# EAGLE design pure_energy (EAGLE 9.5.2)
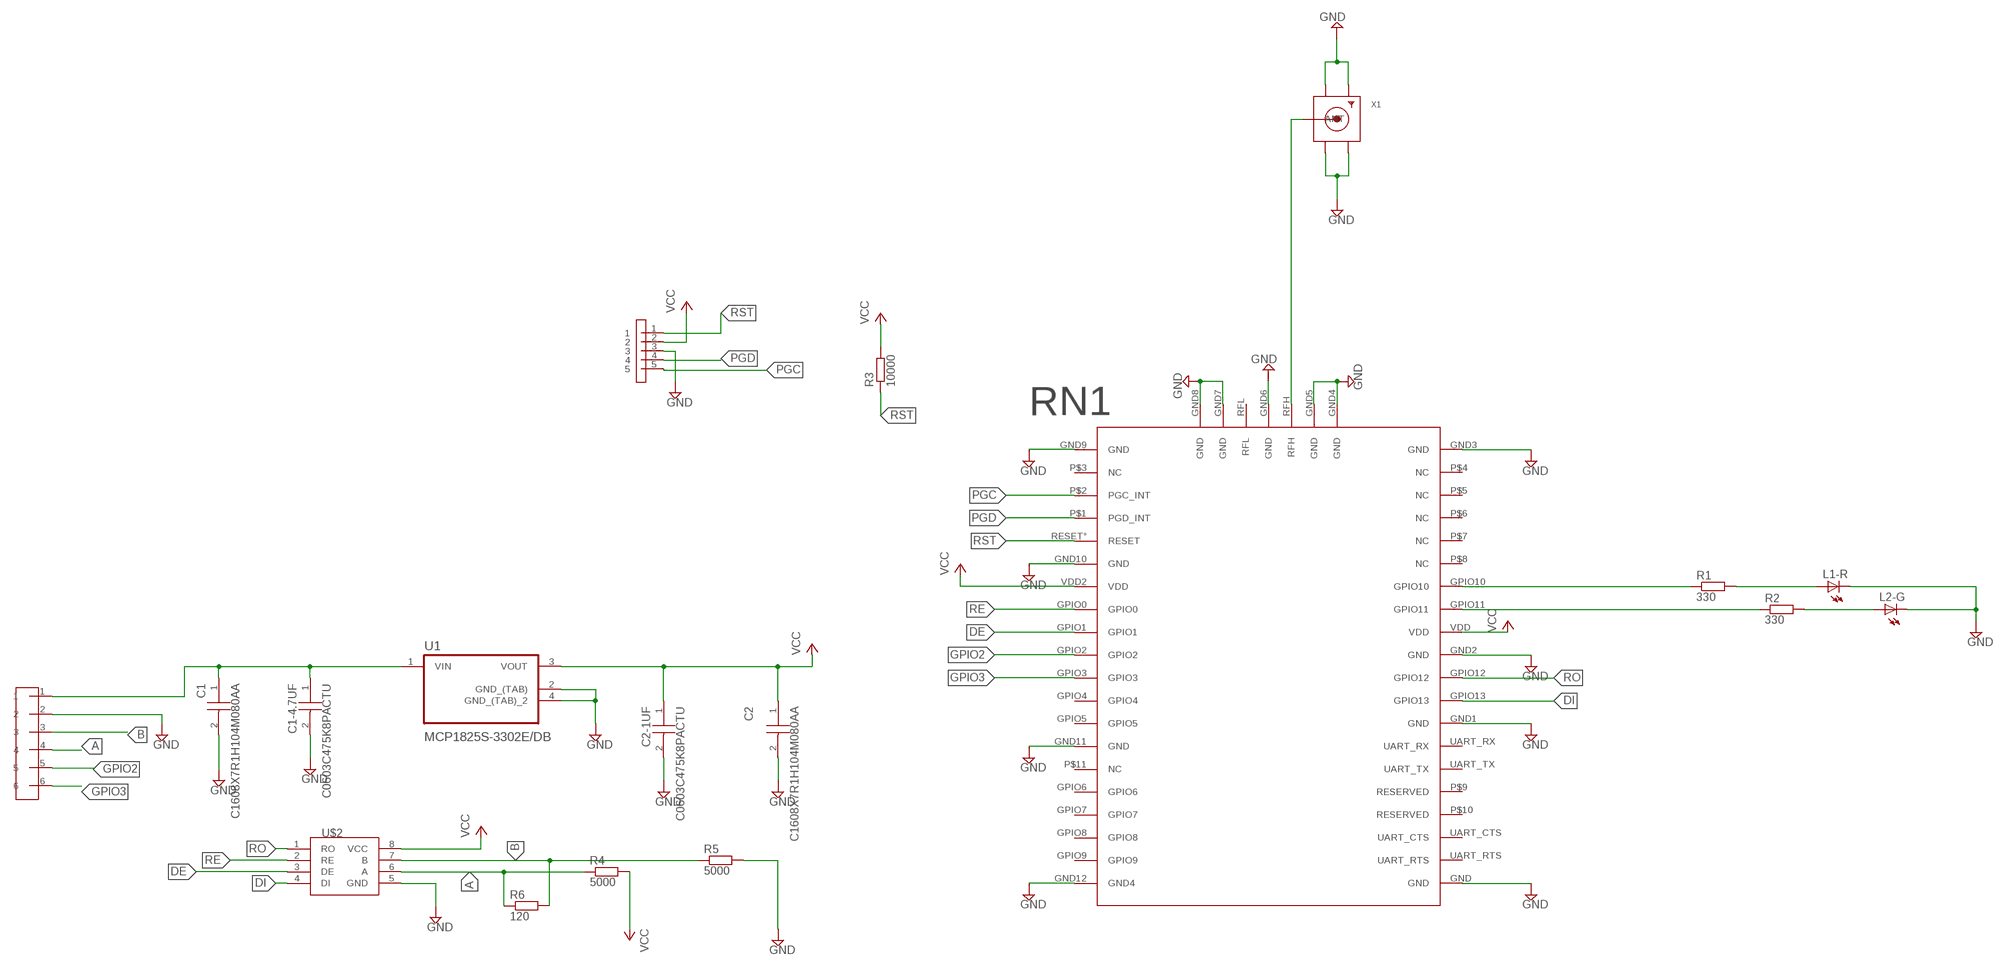
[diagram p0: schematic, sheet 1]

## Parts
C1  C1608X7R1H104M080AA  [CAPC1608X80N]
C1-4.7UF  C0603C475K8PACTU  [CAPC1608X85N]
C2  C1608X7R1H104M080AA  [CAPC1608X80N]
C2-1UF  C0603C475K8PACTU  [CAPC1608X85N]
L1-R  LEDCHIP-LED0603  [CHIP-LED0603]
L2-G  LEDCHIP-LED0603  [CHIP-LED0603]
R1  330  R-EU_R0603  [R0603]
R2  330  R-EU_R0603  [R0603]
R3  10000  R-EU_R0603  [R0603]
R4  5000  R-EU_R0805  [R0805]
R5  5000  R-EU_R0805  [R0805]
R6  120  R-EU_R0805  [R0805]
RN1  NEW_RN2483  [NEW_RN2483]
U1  MCP1825S-3302E/DB  [SOT230P700X180-4N]
U$1  CONNECTOR62  [CONNECTOR6]
U$2  AMD3485E  [AMD3485E]
U$3  ICSP52  [ICSP]
X1  SMACONNECTOR_EDGE  [SMA_EDGELAUNCH]

## Nets
A: R4.1 R6.1 U$1.4 U$2.6(A)
B: R5.1 R6.2 U$1.3 U$2.7(B)
DE: RN1.GPIO1 U$2.3(DE)
DI: RN1.GPIO13 U$2.4(DI)
GND: C1-4.7UF.2(C2) C1.2 C2-1UF.2(C2) C2.2 L1-R.C L2-G.C R5.2 RN1.GND RN1.GND1(GND) RN1.GND2(GND) RN1.GND3(GND) RN1.GND4(GND) RN1.GND5(GND) RN1.GND6(GND) RN1.GND7(GND) RN1.GND8(GND) RN1.GND9(GND) RN1.GND10(GND) RN1.GND11(GND) RN1.GND12(GND4) U1.2(GND_(TAB)) U1.4(GND_(TAB)_2) U$1.2 U$2.5(GND) U$3.3 X1.GND@1(GND4) X1.GND@2(GND3) X1.GND@3(GND2) X1.GND@4(GND1)
GPIO2: RN1.GPIO2 U$1.5
GPIO3: RN1.GPIO3 U$1.6
N$1: C1-4.7UF.1(C1) C1.1 U1.1(VIN) U$1.1
N$10: R1.1 RN1.GPIO10
N$11: R2.1 RN1.GPIO11
N$12: L1-R.A R1.2
N$13: L2-G.A R2.2
N$15: RN1.RFH X1.P(ANT)
PGC: RN1.P$2(PGC_INT) U$3.5
PGD: RN1.P$1(PGD_INT) U$3.4
RE: RN1.GPIO0 U$2.2(RE)
RO: RN1.GPIO12 U$2.1(RO)
RST: R3.1 RN1.RESET°(RESET) U$3.1
VCC: C2-1UF.1(C1) C2.1 R3.2 R4.2 RN1.VDD RN1.VDD2(VDD) U1.3(VOUT) U$2.8(VCC) U$3.2
Unconnected: RN1.GPIO4 RN1.GPIO5 RN1.GPIO6 RN1.GPIO7 RN1.GPIO8 RN1.GPIO9 RN1.P$3(NC) RN1.P$4(NC) RN1.P$5(NC) RN1.P$6(NC) RN1.P$7(NC) RN1.P$8(NC) RN1.P$9(RESERVED) RN1.P$10(RESERVED) RN1.P$11(NC) RN1.RFL RN1.UART_CTS RN1.UART_RTS RN1.UART_RX RN1.UART_TX

## Library data of the parts
C1 C2 = C1608X7R1H104M080AA:C1608X7R1H104M080AA: TDK 0603 C 100nF Ceramic Multilayer Capacitor, 50 V dc, +125C, X7R Dielectric, +/-20% Source: Datasheet <https://product.tdk.com/info/en/catalog/datasheets/mlcc_commercial_midvoltage_en.pdf>; ARROW_PART_NUMBER: C1608X7R1H104M080AA; ARROW_PRICE-STOCK: https://www.arrow.com/en/products/c1608x7r1h104m080aa/tdk; DESCRIPTION: TDK 0603 C 100nF Ceramic Multilayer Capacitor, 50 V dc, +125C, X7R Dielectric, +/-20%; HEIGHT: 0.8mm; MANUFACTURER_NAME: TDK; MANUFACTURER_PART_NUMBER: C1608X7R1H104M080AA; MOUSER_PART_NUMBER: 810-C1608X7R1H104M; MOUSER_PRICE-STOCK: https://www.mouser.co.uk/ProductDetail/TDK/C1608X7R1H104M080AA?qs=dfay7wIA1uEL2BE%2FFUaTdg%3D%3D
C1-4.7UF C2-1UF = C0603C475K8PACTU:C0603C475K8PACTU: CAPACITOR, 0603 4.7uF +/-10% 10V Source: Datasheet <http://componentsearchengine.com/Datasheets/1/C0603C475K8PACTU.pdf>; ARROW_PART_NUMBER: C0603C475K8PACTU; ARROW_PRICE-STOCK: https://www.arrow.com/en/products/c0603c475k8pactu/kemet-corporation; DESCRIPTION: CAPACITOR, 0603 4.7uF +/-10% 10V; HEIGHT: mm; MANUFACTURER_NAME: Kemet; MANUFACTURER_PART_NUMBER: C0603C475K8PACTU; MOUSER_PART_NUMBER: 80-C0603C475K8P; MOUSER_PRICE-STOCK: https://www.mouser.co.uk/ProductDetail/KEMET/C0603C475K8PACTU?qs=K%2Fj%2Fqf%252B0fqK6lAUxhlPmKA%3D%3D
L1-R L2-G = adafruit:LED: LED OSRAM: - CHIPLED LG R971, LG N971, LY N971, LG Q971, LY Q971, LO R971, LY R971 LH N974, LH R974 LS Q976, LO Q976, LY Q976 LO Q996 - Hyper CHIPLED LW Q18S LB Q993, LB Q99A, LB R99A - SideLED LS A670, LO A670, LY A670, LG A670, LP A670 LB A673, LV A673, LT A673, LW A673 LH A674 LY A675 LS A676, LA A676, LO A676, LY A676, LW A676 LS A679, LY A679, LG A679 - Hyper Micro SIDELED® LS Y876, LA Y876, LO Y876, LY Y876 LT Y87S - SmartLED LW L88C, LW L88S LB L89C, LB L89S, LG L890 LS L89K, LO L89K, LY L89K LS L896, LA L896, LO L896, LY L896 - TOPLED LS T670, LO T670, LY T670, LG T670, LP T670 LSG T670, LSP T670, LSY T670, LOP T670, LYG T670 LG T671, LOG T671, LSG T671 LB T673, LV T673, LT T673, LW T673 LH T674 LS T676, LA T676, LO T676, LY T676, LB T676, LH T676, LSB T676, LW T676 LB T67C, LV T67C, LT T67C, LS T67K, LO T67K, LY T67K, LW E67C LS E67B, LA E67B, LO E67B, LY E67B, LB E67C, LV E67C, LT E67C LW T67C LS T679, LY T679, LG T679 LS T770, LO T770, LY T770, LG T770, LP T770 LB T773, LV T773, LT T773, LW T773 LH T774 LS E675, LA E675, LY E675, LS T675 LS T776, LA T776, LO T776, LY T776, LB T776 LHGB T686 LT T68C, LB T68C - Hyper Mini TOPLED® LB M676 - Mini TOPLED Santana® LG M470 LS M47K, LO M47K, LY M47K Source: http://www.osram.convergy.de/
R1-R6 = rcl:R-EU_: RESISTOR, European symbol; SPICEPREFIX: R
RN1 = tobias:NEW_RN2483
U1 = MCP1825S-3302E_DB:MCP1825S-3302E/DB; AVAILABILITY: Unavailable; DESCRIPTION: Linear Voltage Regulator IC 1 Output 500mA SOT-223-3; MF: Microchip; MP: MCP1825S-3302E/DB; PACKAGE: SOT-223 Microchip; PRICE: None
U$1 = conn4:CONNECTOR62
U$2 = AMD3485E:AMD3485E
U$3 = conn4:ICSP52
X1 = adafruit:SMACONNECTOR: SMA Connector 90° DIP SMA Connector, 50 Ohm (4UConnector: 07259)

## Net classes
0 default: width 0.305 mm, drill 0.508 mm, clearance 0.254 mm

## Board
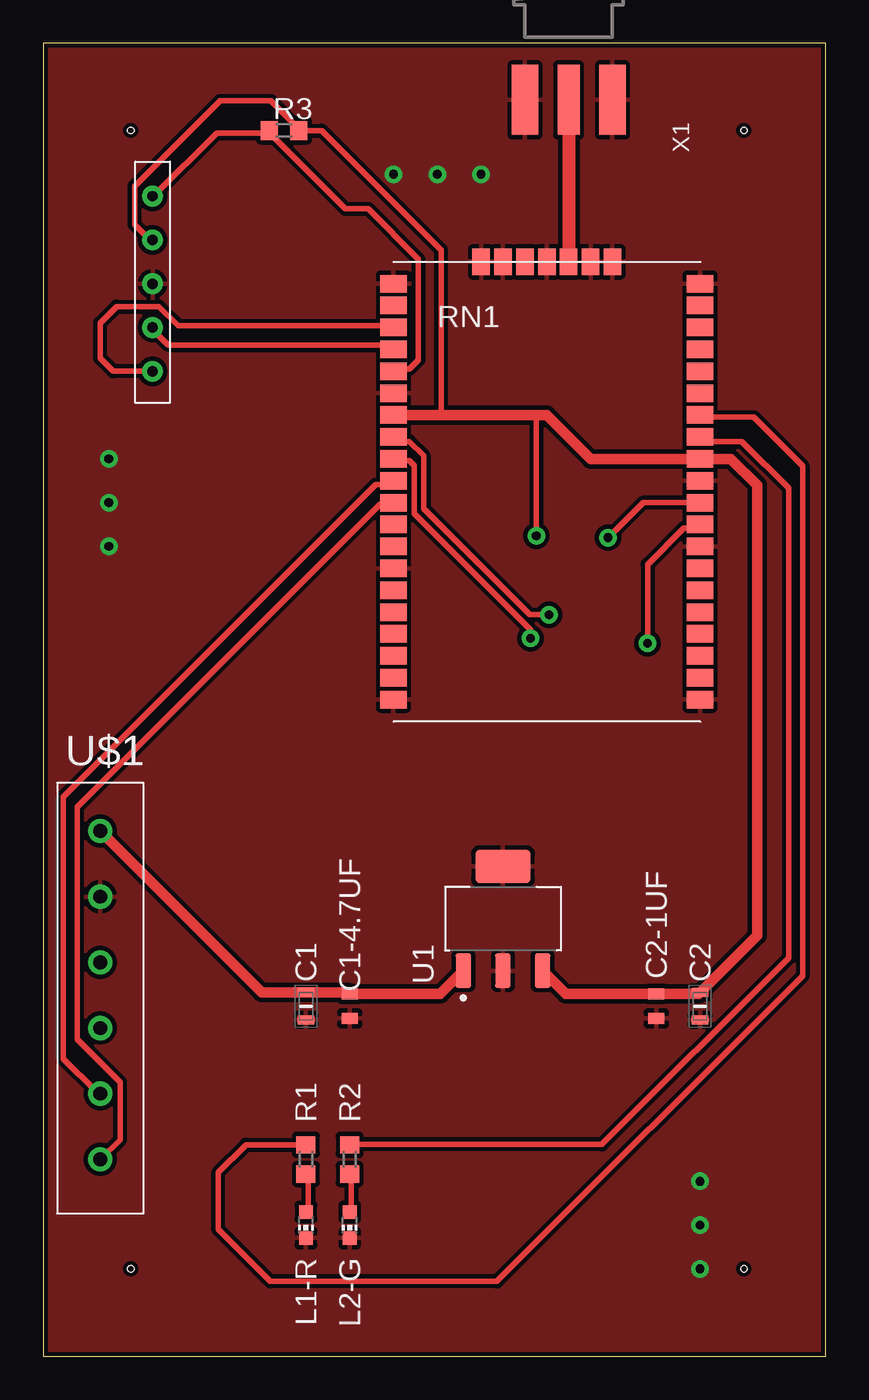
[diagram p1: board, top side]
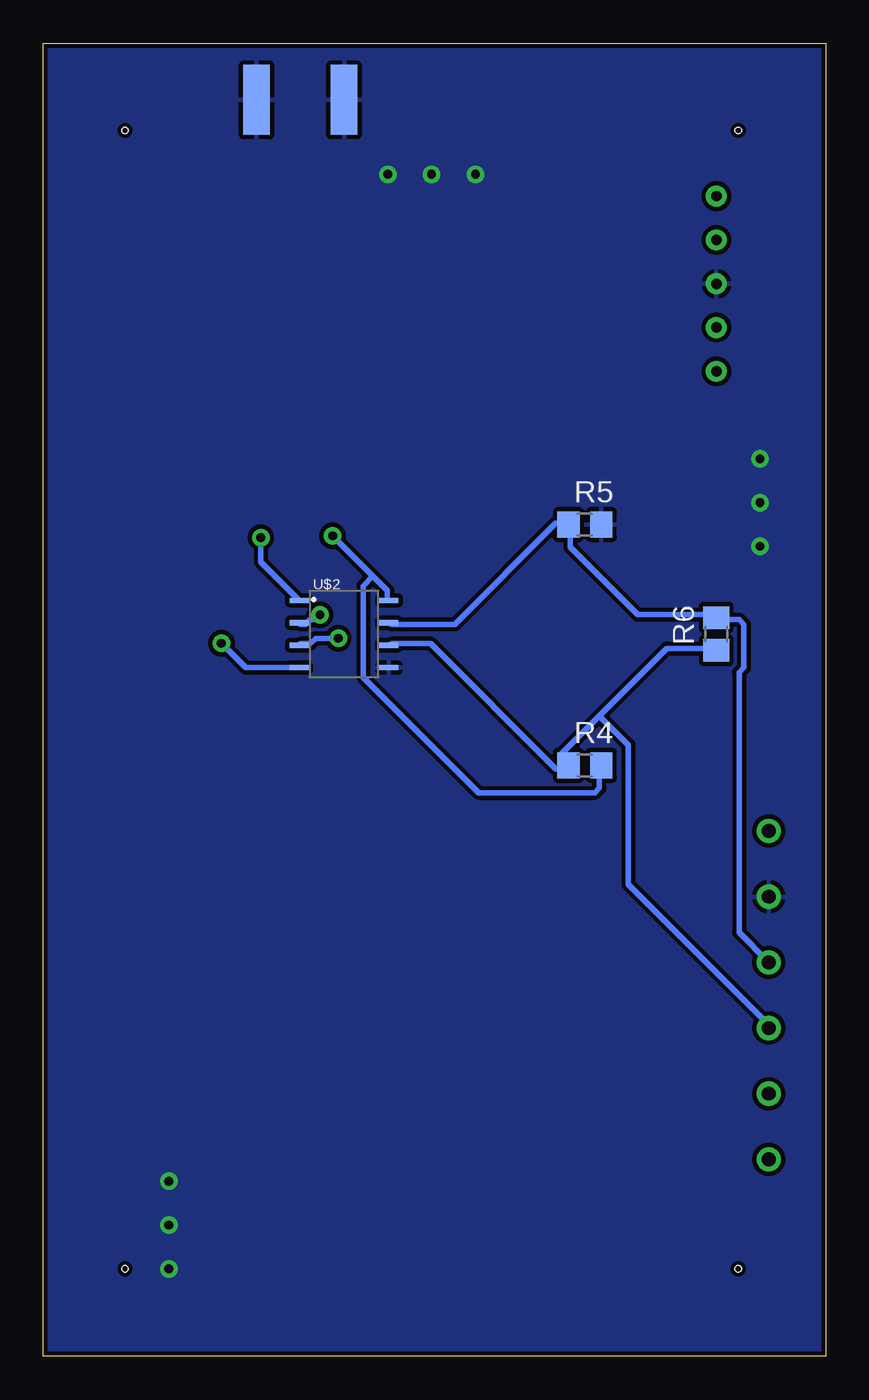
[diagram p2: board, bottom side, seen from below]

Size 45.39 x 76.19 mm. Coordinates in mm from the lower left corner, seen from the top.
Outline: 0,0 45.39,0 45.39,76.19 0,76.19 0,0
Copper layers (1*16): Top 0.035mm / dielectric 1.5mm / Bottom 0.035mm
Design rules "SparkFun": minimum track width 8mil, minimum drill 20mil, track to track 8mil, track to pad 8mil, pad to pad 8mil, via to via 8mil, smd to smd 8mil, copper to edge 10mil, drill to drill 8mil, minimum pad ring 12mil, minimum via ring 10mil, stop-mask expansion 4mil, vias tented up to drill 25mil, thermal gap 10mil
Holes 0.35 mm at 40.64,71.12 5.08,71.12 5.08,5.08 40.64,5.08

### Footprints (pad centres in the part's own frame; a part is rotated, then mirrored left to right if it is on the bottom)
CAPC1608X80N = smd 0.54 x 0.94: 1 -0.8,0; 2 0.8,0
CAPC1608X85N = smd 0.66 x 0.94: 1 -0.711,0; 2 0.711,0
CHIP-LED0603 = smd 0.8 x 0.8: A 0,-0.75; C 0,0.75
R0603 = smd 1 x 1.1: 1 -0.85,0; 2 0.85,0
R0805 = smd 1.3 x 1.5: 1 -0.95,0; 2 0.95,0
NEW_RN2483 = smd 1.524 x 1.016: GND 17.78,1.27; GND1 17.78,10.16; GND2 17.78,13.97; GND3 17.78,25.4; GND9 0,25.4; GND10 0,19.05; GND11 0,8.89; GND12 0,1.27; GPIO0 0,16.51; GPIO1 0,15.24; GPIO2 0,13.97; GPIO3 0,12.7; GPIO4 0,11.43; GPIO5 0,10.16; GPIO6 0,6.35; GPIO7 0,5.08; GPIO8 0,3.81; GPIO9 0,2.54; GPIO10 17.78,17.78; GPIO11 17.78,16.51; GPIO12 17.78,12.7; GPIO13 17.78,11.43; P$1 0,21.59; P$2 0,22.86; P$3 0,24.13; P$4 17.78,24.13; P$5 17.78,22.86; P$6 17.78,21.59; P$7 17.78,20.32; P$8 17.78,19.05; P$9 17.78,6.35; P$10 17.78,5.08; P$11 0,7.62; RESET° 0,20.32; UART_CTS 17.78,3.81; UART_RTS 17.78,2.54; UART_RX 17.78,8.89; UART_TX 17.78,7.62; VDD 17.78,15.24; VDD2 0,17.78 | smd 1.016 x 1.524: GND4 12.7,26.67; GND5 11.43,26.67; GND6 8.89,26.67; GND7 6.35,26.67; GND8 5.08,26.67; RFH 10.16,26.67; RFL 7.62,26.67
SOT230P700X180-4N = smd 1.97 x 0.89: 1 -3.025,2.3; 2 -3.025,0; 3 -3.025,-2.3 | smd 1.97 x 3.19: 4 3.025,0
CONNECTOR6 = drill 0.8: 1 -0.5,-3.81; 2 -0.5,-7.62; 3 -0.5,-11.43; 4 -0.5,-15.24; 5 -0.5,-19.05; 6 -0.5,-22.86
AMD3485E = smd 1.1 x 0.3: 1 -2.6,1.95; 2 -2.6,0.65; 3 -2.6,-0.65; 4 -2.6,-1.95; 5 2.6,-1.95; 6 2.6,-0.65; 7 2.6,0.65; 8 2.6,1.95
ICSP = drill 0.6: 1 -0.002,-0.002; 2 -0.002,-2.542; 3 -0.002,-5.082; 4 -0.002,-7.622; 5 -0.002,-10.162
SMA_EDGELAUNCH = smd 4.064 x 1.524: GND@1 2.032,-2.54; GND@2 2.032,2.54 | smd 4.064 x 1.524 bottom: GND@3 2.032,2.54; GND@4 2.032,-2.54 | smd 4.064 x 1.27: P 2.032,0

### Placement (x,y rotation side)
C1  15.24,20.32 270 top
C1-4.7UF  17.78,20.32 270 top
C2  38.1,20.32 270 top
C2-1UF  35.56,20.32 270 top
L1-R  15.24,7.62 180 top
L2-G  17.78,7.62 180 top
R1  15.24,11.43 270 top
R2  17.78,11.43 270 top
R3  13.97,71.12 0 top
R4  13.97,34.29 0 bottom
R5  13.97,48.26 0 bottom
R6  6.35,41.91 90 bottom
RN1  20.32,36.83 0 top
U1  26.67,25.4 90 top
U$1  3.81,34.29 0 top
U$2  27.94,41.91 0 bottom
U$3  6.35,67.31 0 top
X1  30.48,74.93 270 top

### Tracks (layer width: path | path; a pad name or v marks a point on that pad's centre or on a via)
A
  Bottom 0.305: 15.37,34.09 15.09,34.09 R4.1 15.37,34.09 | 15.37,34.09 15.65,34.09 22.91,41.35 25.15,41.35 U$2.6 | 13.13,37.16 15.37,34.92 15.37,34.09 | 13.13,37.16 9.22,41.07 6.43,41.07 R6.1 | 13.13,37.16 11.46,35.48 11.46,27.38 3.35,19.28 U$1.4
B
  Bottom 0.305: U$2.7 25.15,42.47 21.51,42.47 15.65,48.34 15.09,48.34 R5.1 14.81,48.06 14.81,46.94 10.9,43.03 6.43,43.03 R6.2 6.15,42.75 5.03,42.75 4.75,42.47 4.75,39.95 5.03,39.67 5.03,24.59 3.35,22.91 U$1.3
DE  (via drill 0.51)
  Top 0.305: v28.27,41.66 28.27,42.14 21.51,48.9 21.51,51.69 21.23,51.97 20.4,51.97 RN1.GPIO1
  Bottom 0.305: v28.27,41.66 29.59,41.66 29.9,41.35 30.45,41.35 U$2.3
DI  (via drill 0.51)
  Top 0.305: v35.05,41.38 35.05,45.95 37.16,48.06 38,48.06 RN1.GPIO13
  Bottom 0.305: v35.05,41.38 33.63,39.96 U$2.4
GND  (via drill 0.51)
  other vias: 20.32,68.58 22.86,68.58 25.4,68.58 3.81,52.07 3.81,49.53 3.81,46.99 38.1,10.16 38.1,7.62 38.1,5.08
  pour Top: -3.81,86.36 102.87,86.36 102.87,-3.81 107.95,-8.89 -1.27,-8.89 -7.62,-2.54 -7.62,82.55
  pour Bottom: -8.89,87.63 -6.35,90.17 105.41,90.17 105.41,0 114.3,-8.89 107.95,-15.24 100.33,-15.24 0,-15.24 -19.05,3.81 -19.05,77.47
GPIO2
  Top 0.305: RN1.GPIO2 20.12,50.57 19.28,50.57 1.17,32.46 1.17,17.27 3.07,15.37 U$1.5
GPIO3
  Top 0.305: RN1.GPIO3 20.12,49.45 19.56,49.45 1.98,31.88 1.98,18.39 4.47,15.9 4.47,12.57 3.35,11.46 U$1.6
N$1
  Top 0.305: 17.69,21.12 C1-4.7UF.1
  Top 0.61: U$1.1 12.67,21.12 C1.1 17.69,21.12 | C1-4.7UF.1 23.03,21.03 U1.1
N$10
  Top 0.305: RN1.GPIO10 38.28,54.48 41.22,54.48 44.04,51.66 44.04,22.07 26.31,4.34 13.18,4.34 10.16,7.37 10.16,10.67 11.77,12.28 R1.1
N$11
  Top 0.305: R2.1 17.88,12.29 32.41,12.29 43.23,23.11 43.23,50.37 40.51,53.09 38.28,53.09 RN1.GPIO11
N$12
  Top 0.305: L1-R.A 15.37,8.38 15.37,10.34 R1.2
N$13
  Top 0.305: L2-G.A 17.88,8.38 17.88,10.34 R2.2
N$15
  Top 0.762: X1.P RN1.RFH
PGC
  Top 0.305: RN1.P$2 20.12,59.79 7.82,59.79 6.71,60.91 4.27,60.91 3.3,59.94 3.3,57.91 4.07,57.15 U$3.5
PGD
  Top 0.305: RN1.P$1 20.12,58.67 7.26,58.67 6.43,59.51 U$3.4
RE  (via drill 0.51)
  Top 0.305: v29.34,43.03 28.22,43.03 22.07,49.17 22.07,52.25 21.23,53.09 20.4,53.09 RN1.GPIO0
  Bottom 0.305: v29.34,43.03 29.62,42.75 29.9,42.75 30.18,42.47 30.45,42.47 U$2.2
RO  (via drill 0.51)
  Top 0.305: RN1.GPIO12 34.8,49.53 v32.77,47.5
  Bottom 0.305: v32.77,47.5 32.77,46.09 U$2.1
RST
  Top 0.305: U$3.1 6.43,67.33 10.06,70.97 12.85,70.97 R3.1 13.13,70.97 17.53,66.57 18.85,66.57 21.77,63.65 21.77,57.81 21.23,57.28 20.4,57.28 RN1.RESET°
VCC  (via drill 0.51)
  Top 0.305: 38.01,21.03 C2.1 | U$3.2 6.15,64.82 5.31,65.66 5.31,67.89 10.26,72.85 13.21,72.85 14.81,71.25 R3.2 16.15,71.12 23.09,64.19 23.09,54.61 | 28.6,54.61 v28.6,47.6
  Top 0.61: U1.3 30.31,21.03 C2-1UF.1 38.01,21.03 | C2.1 41.4,24.42 41.4,50.55 39.88,52.07 RN1.VDD 31.75,52.07 29.21,54.61 28.6,54.61 23.09,54.61 RN1.VDD2
  Bottom 0.305: v28.6,47.6 26.26,45.26 | 26.26,45.26 25.43,44.42 25.43,43.87 U$2.8 | 26.26,45.26 26.82,44.7 26.82,39.4 20.12,32.69 13.41,32.69 13.13,32.97 13.13,34.09 R4.2

### Text on the board
tNames: U$1